# EAGLE design SparkFun_SC16IS750_Breakout-v13 (EAGLE 5.09)
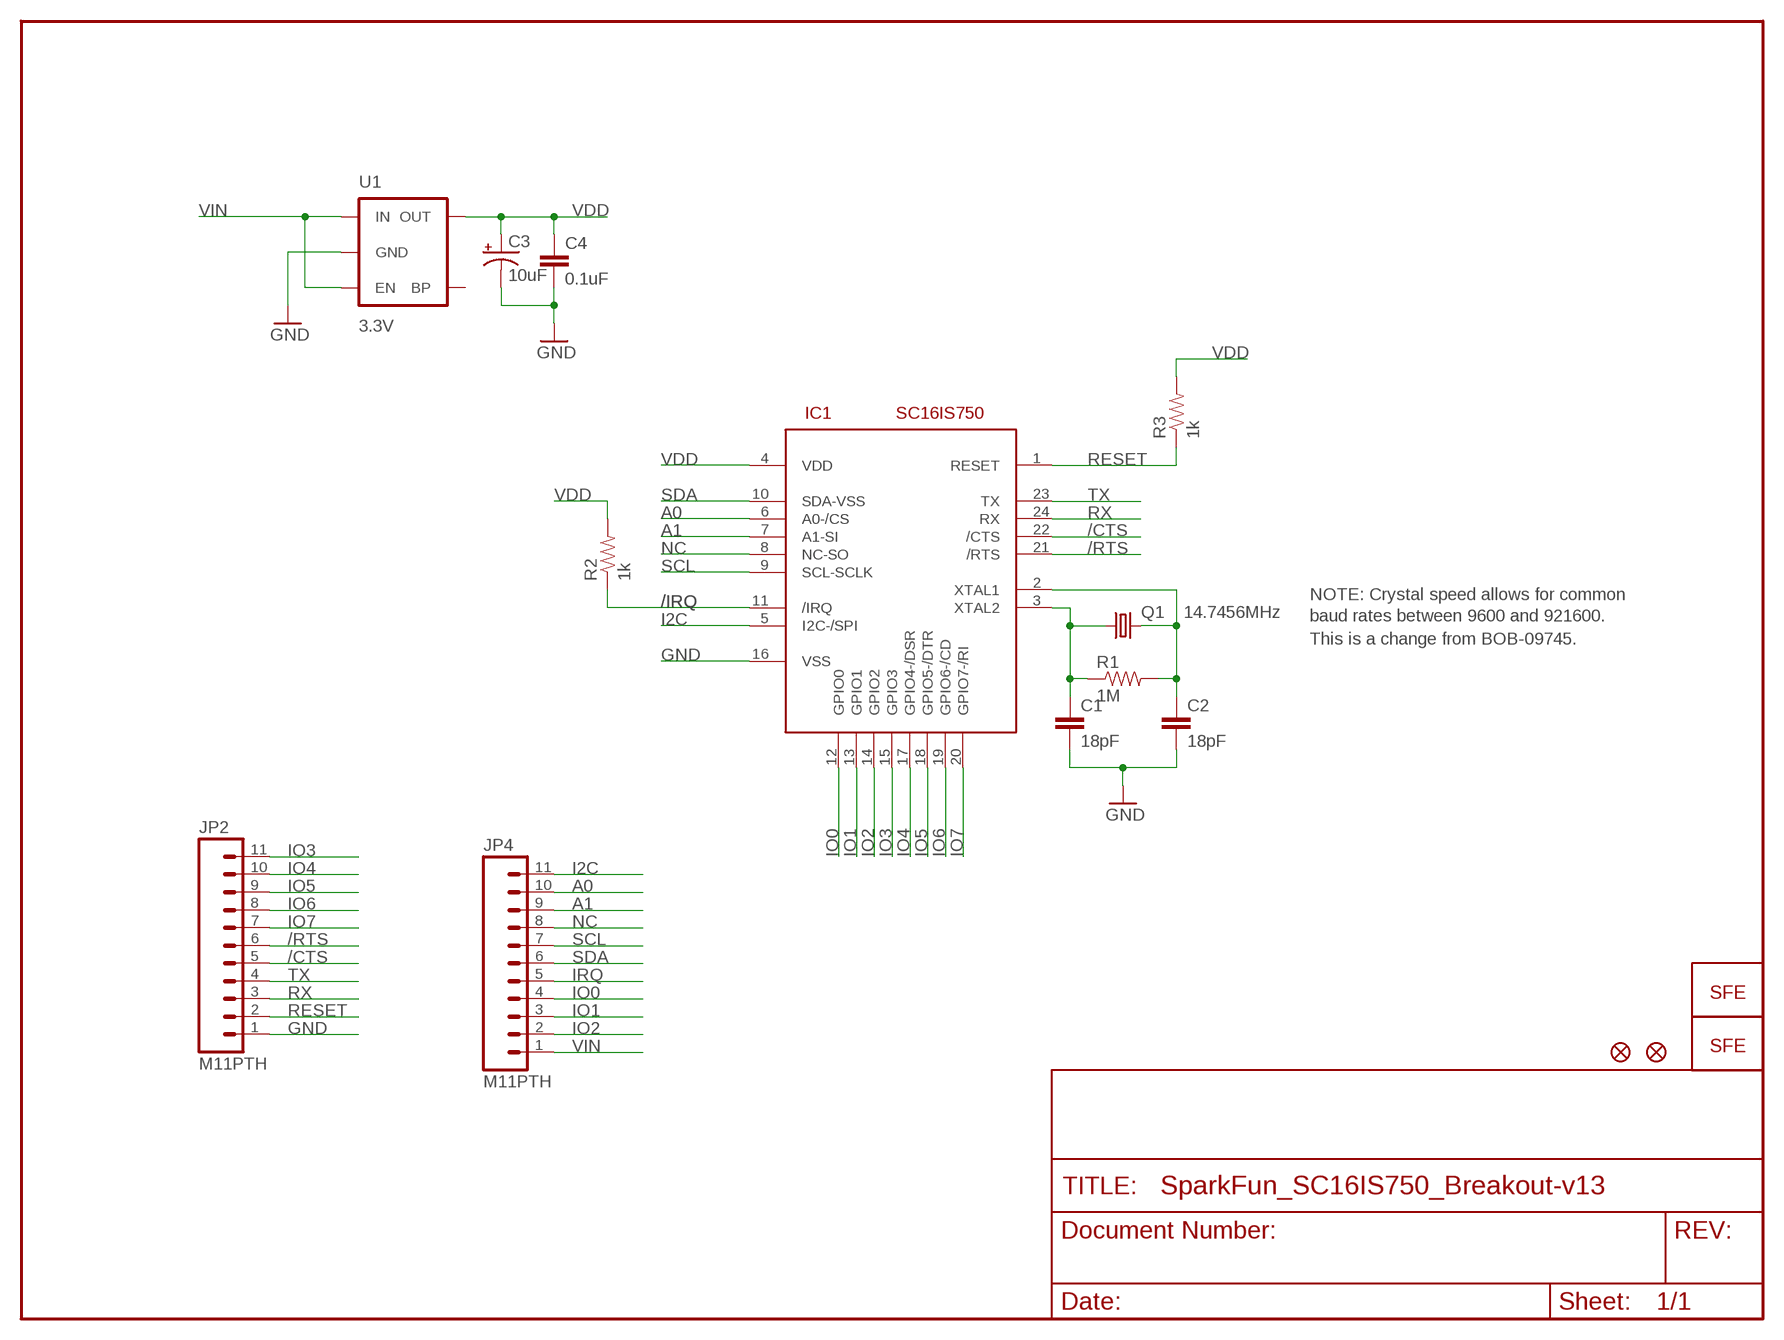
[diagram p0: schematic, sheet 1]

## Parts
C1  18pF  CAP0402-CAP  [0402-CAP]
C2  18pF  CAP0402-CAP  [0402-CAP]
C3  10uF  CAP_POL1206  [EIA3216]
C4  0.1uF  CAP0402-CAP  [0402-CAP]
IC1  SC16IS750  [QFN-24]
JP1  LOGO-SFENEW  [SFE-NEW-WEBLOGO]
JP2  M11PTH  [1X11]
JP3  LOGO-SFESK  [SFE-LOGO-FLAME]
JP4  M11PTH  [1X11]
JP5  FIDUCIAL1X2  [FIDUCIAL-1X2]
JP6  FIDUCIAL1X2  [FIDUCIAL-1X2]
Q1  14.7456MHz  CRYSTAL5X3  [CRYSTAL-SMD-5X3]
R1  1M  RESISTOR0402-RES  [0402-RES]
R2  1k  RESISTOR0402-RES  [0402-RES]
R3  1k  RESISTOR0402-RES  [0402-RES]
U1  3.3V  V_REG_LDOSMD  [SOT23-5]

## Nets
/CTS: IC1.22(/CTS) JP2.5
/IRQ: IC1.11(/IRQ) R2.1
/RTS: IC1.21(/RTS) JP2.6
A0: IC1.6(A0-/CS) JP4.10
A1: IC1.7(A1-SI) JP4.9
GND: C1.2 C2.2 C3.C(-) C4.2 IC1.16(VSS) JP2.1 U1.2(GND)
I2C: IC1.5(I2C-/SPI) JP4.11
IO0: IC1.12(GPIO0) JP4.4
IO1: IC1.13(GPIO1) JP4.3
IO2: IC1.14(GPIO2) JP4.2
IO3: IC1.15(GPIO3) JP2.11
IO4: IC1.17(GPIO4-/DSR) JP2.10
IO5: IC1.18(GPIO5-/DTR) JP2.9
IO6: IC1.19(GPIO6-/CD) JP2.8
IO7: IC1.20(GPIO7-/RI) JP2.7
IRQ: JP4.5
N$23: C1.1 IC1.3(XTAL2) Q1.1 R1.1
N$24: C2.1 IC1.2(XTAL1) Q1.3 R1.2
NC: IC1.8(NC-SO) JP4.8
RESET: IC1.1(RESET) JP2.2 R3.1
RX: IC1.24(RX) JP2.3
SCL: IC1.9(SCL-SCLK) JP4.7
SDA: IC1.10(SDA-VSS) JP4.6
TX: IC1.23(TX) JP2.4
VDD: C3.A(+) C4.1 IC1.4(VDD) R2.2 R3.2 U1.5(OUT)
VIN: JP4.1 U1.1(IN) U1.3(EN)
Unconnected: U1.4(BP)

## Notes on the sheet
- NOTE: Crystal speed allows for common
- baud rates between 9600 and 921600.
- This is a change from BOB-09745.

## Library data of the parts
C1 C2 C4 = SparkFun:CAP: Capacitor Standard 0603 ceramic capacitor, and 0.1" leaded capacitor.
C3 = SparkFun:CAP_POL: Capacitor Polarized These are standard SMD and PTH capacitors. Normally 10uF, 47uF, and 100uF in electrolytic and tantalum varieties. Always verify the external diameter of the through hole cap, it varies with capacity, voltage, and manufacturer. The EIA devices should be standard.
IC1 = SparkFun:SC16IS750
JP1 JP3 = SparkFun:LOGO-SFE: Spark Fun Electronics PCB Logo This is the standard Spark Fun Electronics PCB logo.
JP2 JP4 = SparkFun:M11: Header 11 Standard 11-pin 0.1" header. Use with straight break away headers (SKU : PRT-00116), right angle break away headers (PRT-00553), swiss pins (PRT-00743), machine pins (PRT-00117), and female headers (PRT-00115).
JP5 JP6 = SparkFun:FIDUCIAL: Fiducial Alignment Points Various fiducial points for machine vision alignment.
Q1 = SparkFun:CRYSTAL: Crystals Various standard crystals. Proven footprints. Spark Fun Electronics SKU : COM-00534
R1-R3 = SparkFun:RESISTOR: Resistor Basic schematic elements and footprints for 0603, 1206, and PTH 1/10th watt (small) resistors.
U1 = SparkFun:V_REG_LDO: Voltage Regulator LDO Standard 150mA LDO voltage regulator in SOT-23 layout. Micrel part MIC5205. BP (by-pass) pin is used to lower output noise with 470pF cap.

## Board
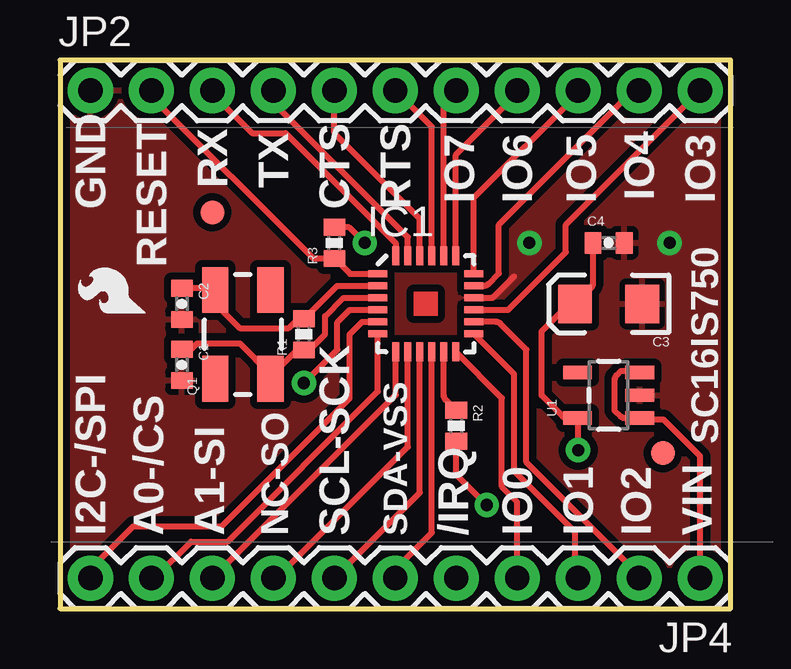
[diagram p1: board, top side]
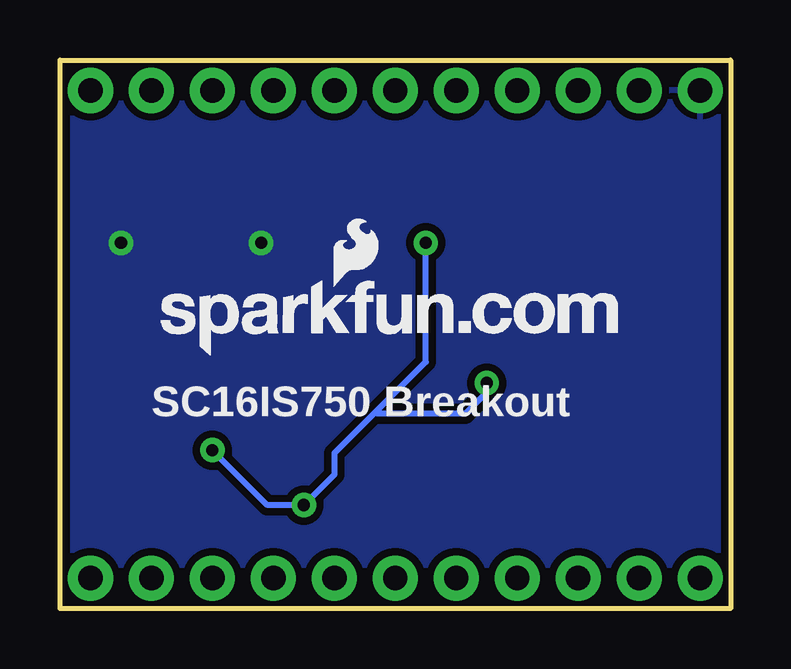
[diagram p2: board, bottom side, seen from below]

Size 27.94 x 22.86 mm. Coordinates in mm from the lower left corner, seen from the top.
Outline: 0,0 27.94,0 27.94,22.86 0,22.86 0,0
Copper layers (1*16): Top 0.035mm / dielectric 1.5mm / Bottom 0.035mm
Design rules "SparkFun *": minimum track width 8mil, minimum drill 20mil, track to track 8mil, track to pad 8mil, pad to pad 7mil, via to via 8mil, smd to smd 8mil, copper to edge 9mil, drill to drill 8mil, minimum pad ring 12mil, minimum via ring 10mil, stop-mask expansion 4mil, vias tented up to drill 20mil, thermal gap 10mil

### Footprints (pad centres in the part's own frame; a part is rotated, then mirrored left to right if it is on the bottom)
0402-CAP = smd 0.7 x 0.9: 1 -0.65,0; 2 0.65,0
EIA3216 = smd 1.4 x 1.6: A 1.4,0; C -1.4,0
QFN-24 = smd 0.8 x 0.3: 1 -2,1.25; 2 -2,0.75; 3 -2,0.25; 4 -2,-0.25; 5 -2,-0.75; 6 -2,-1.25; 13 2,-1.25; 14 2,-0.75; 15 2,-0.25; 16 2,0.25; 17 2,0.75; 18 2,1.25 | smd 0.3 x 0.8: 7 -1.25,-2; 8 -0.75,-2; 9 -0.25,-2; 10 0.25,-2; 11 0.75,-2; 12 1.25,-2; 19 1.25,2; 20 0.75,2; 21 0.25,2; 22 -0.25,2; 23 -0.75,2; 24 -1.25,2
1X11 = drill 1.016 pad 1.88 round: 1 0,0; 2 2.54,0; 3 5.08,0; 4 7.62,0; 5 10.16,0; 6 12.7,0; 7 15.24,0; 8 17.78,0; 9 20.32,0; 10 22.86,0; 11 25.4,0
FIDUCIAL-1X2 = smd 1 x 1: 1 0,0
CRYSTAL-SMD-5X3 = smd 1.9 x 1.1: 1 -1.85,-1.15; 2 1.85,-1.15; 3 1.85,1.15; 4 -1.85,1.15
0402-RES = smd 0.7 x 0.9: 1 -0.65,0; 2 0.65,0
SOT23-5 = smd 0.55 x 1.2: 1 -0.95,-1.3; 2 0,-1.3; 3 0.95,-1.3; 4 0.95,1.3; 5 -0.95,1.3

### Placement (x,y rotation side)
C1  5.08,10.16 270 top
C2  5.08,12.7 270 top
C3  22.86,12.7 180 top
C4  22.86,15.24 0 top
IC1  15.24,12.7 0 top
JP1  23.75,10.54 0 bottom
JP2  1.27,21.59 0 top
JP3  3.56,12.32 90 top
JP4  26.67,1.27 180 top
JP5  6.35,16.51 0 top
JP6  25.12,6.48 0 top
Q1  7.62,11.43 90 top
R1  10.16,11.43 90 top
R2  16.51,7.62 270 top
R3  11.43,15.24 90 top
U1  22.86,8.89 90 top

### Tracks (layer width: path | path; a pad name or v marks a point on that pad's centre or on a via)
/CTS
  Top 0.254: IC1.22 14.99,16.25 11.43,19.81 JP2.5
/IRQ
  Top 0.254: R2.1 16.51,8.26 16.06,8.7 arc-45 15.99,8.88 IC1.11
/RTS
  Top 0.254: IC1.21 15.49,20.07 JP2.6
A0
  Top 0.254: IC1.6 13.24,9.05 6.99,2.79 5.46,2.79 3.94,1.27 JP4.10
A1
  Top 0.254: IC1.7 13.99,8.91 JP4.9
GND  (via drill 0.51)
  Top 0.254: IC1.16 18.03,12.95 18.92,13.84
  other vias: 19.56,15.24 25.4,15.24
  pour Top (isolate 0.305): 0,22.86 0,0 27.94,0 27.94,22.86
  pour Bottom (isolate 0.305): 0,22.86 0,0 27.94,0 27.94,22.86
I2C
  Top 0.254: JP4.11 1.27,1.65 3.05,3.43 6.73,3.43 12.06,8.76 12.06,11.43 12.59,11.95 IC1.5
IO0
  Top 0.254: IC1.12 18.41,8.78 18.41,5.08 19.05,4.45 JP4.4 19.18,1.27
IO1
  Top 0.254: JP4.3 21.46,1.14 21.46,2.29 | 21.46,2.29 21.46,2.54 | IC1.13 18.92,9.77 18.92,5.71 21.46,3.17 21.46,2.29
IO2
  Top 0.254: IC1.14 18.17,11.95 arc-45 18.35,11.88 19.43,10.79 19.43,6.1 24.13,1.4 JP4.2
IO3
  Top 0.254: IC1.15 18.67,12.45 21.08,14.86 21.08,16 JP2.11
IO4
  Top 0.254: IC1.17 17.66,13.45 arc45 17.84,13.52 18.29,13.97 18.29,16 23.88,21.59 JP2.10
IO5
  Top 0.254: JP2.9 21.59,21.46 17.24,17.11 IC1.18
IO6
  Top 0.254: JP2.8 19.18,21.59 16.49,18.9 IC1.19
IO7
  Top 0.254: IC1.20 15.99,21.07 JP2.7
N$23
  Top 0.254: C1.1 5.48,10.81 5.71,11.05 7.49,11.05 8.77,9.77 Q1.1 8.77,9.64 8.76,9.65 9.89,10.78 R1.1 10.18,10.78 10.29,10.67 11.05,11.43 11.05,12.19 11.81,12.95 IC1.3
N$24
  Top 0.254: C2.1 6.46,13.35 6.48,13.34 6.47,13.33 Q1.3 6.47,13.21 6.48,13.21 6.48,12.7 7.49,11.68 9.53,11.68 9.92,12.08 R1.2 10.16,12.06 11.54,13.45 IC1.2
NC
  Top 0.254: JP4.8 9.02,1.27 14.49,6.74 IC1.8
RESET
  Top 0.254: 11.45,14.59 R3.1 | IC1.1 12.09,13.95 11.45,14.59 | JP2.2 3.68,21.46 10.56,14.59 11.45,14.59
RX
  Top 0.254: IC1.24 13.99,15.22 9.4,19.81 8,19.81 6.35,21.46 JP2.3
SCL
  Top 0.254: IC1.9 14.99,4.83 JP4.7
SDA
  Top 0.254: JP4.6 13.97,1.65 15.49,3.17 IC1.10
TX
  Top 0.254: IC1.23 14.49,15.48 8.89,21.08 JP2.4
VDD  (via drill 0.51)
  Top 0.254: C4.1 22.21,13.55 arc-45 22.14,13.37 C3.A C3.A arc44 C3.A 21.34,12.83 20.07,11.56 20.07,8.89 20.94,8.01 arc45 21.12,7.94 U1.5 21.56,7.9 21.59,7.87 v21.59,6.6 | R3.2 12.05,15.89 v12.7,15.24 | IC1.4 12.07,12.45 11.56,11.94 11.56,10.79 v10.16,9.4 | R2.2 16.51,5.59 v17.78,4.32
  Bottom 0.254: v12.7,15.24 12.7,10.29 14.8,8.19 | v10.16,9.4 10.16,9.02 11.05,8.13 14.73,8.13 14.8,8.19 | v21.59,6.6 19.3,4.32 v17.78,4.32 16.51,5.59 16.51,6.48 14.8,8.19
VIN
  Top 0.254: U1.3 arc45 24.21,9.86 24.26,9.91 23.37,9.91 23.19,9.73 arc45 23.11,9.55 23.11,8.26 23.36,8.01 arc45 23.53,7.94 U1.1 arc-45 24.14,7.88 24.13,7.87 25.15,7.87 26.67,6.35 JP4.1

### Text on the board
tPlace: RX | TX | GND | CTS | RTS | IO7 | IO6 | IO5 | IO4 | IO3 | RESET | SC16IS750 | I2C-/SPI | A0-/CS | A1-SI | NC-SO | SCL-SCK | SDA-VSS | /IRQ | IO0 | IO1 | IO2 | VIN
bPlace: SC16IS750 Breakout